# Altium schematic sheet S7CAS-PLEIADES-CARTE-MERE_P20_FPGA-decoupling.SchDoc
size Tabloid; Sheet_Name: Insert name in Document Parameters; Size: 11x17
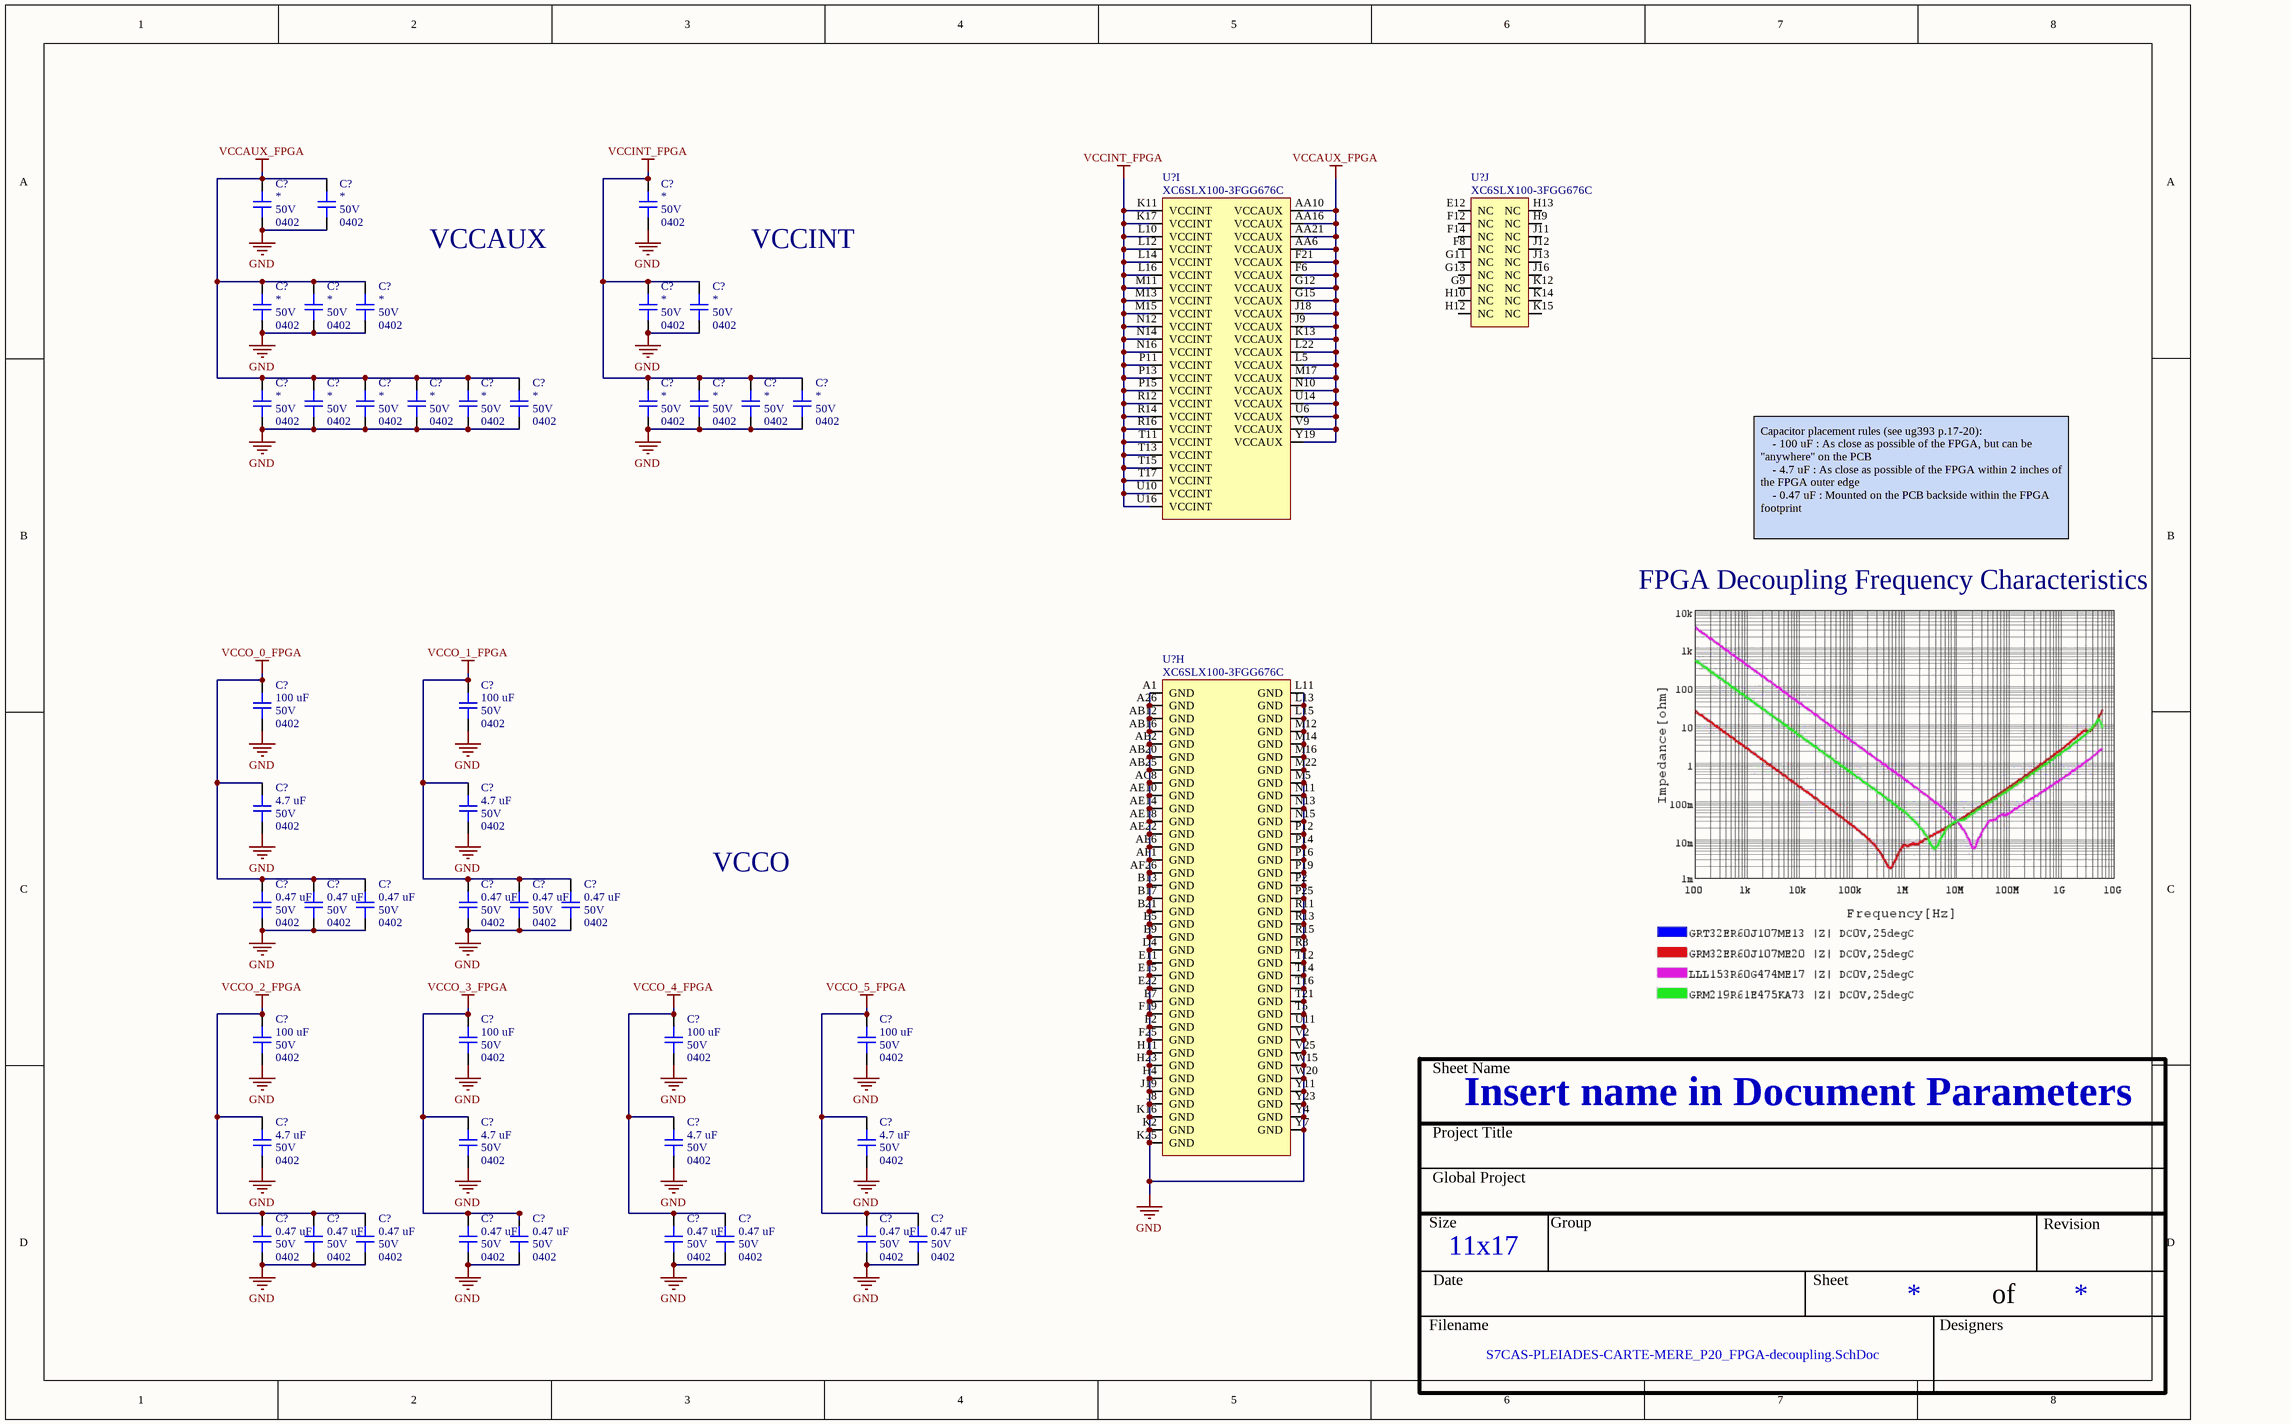
[diagram p0: S7CAS-PLEIADES-CARTE-MERE_P20_FPGA-decoupling.SchDoc]

## Parts
(Parts that share a designator on the sheet are numbered #1, #2 ... from top to bottom, then left to right.)
C?#1  Voltage: 50V  Package: 0402  [CAP_0402]  (hidden comment: CAP - 0402)
C?#2  Voltage: 50V  Package: 0402  [CAP_0402]  (hidden comment: CAP - 0402)
C?#3  Voltage: 50V  Package: 0402  [CAP_0402]  (hidden comment: CAP - 0402)
C?#4  Voltage: 50V  Package: 0402  [CAP_0402]  (hidden comment: CAP - 0402)
C?#5  Voltage: 50V  Package: 0402  [CAP_0402]  (hidden comment: CAP - 0402)
C?#6  Voltage: 50V  Package: 0402  [CAP_0402]  (hidden comment: CAP - 0402)
C?#7  Voltage: 50V  Package: 0402  [CAP_0402]  (hidden comment: CAP - 0402)
C?#8  Voltage: 50V  Package: 0402  [CAP_0402]  (hidden comment: CAP - 0402)
C?#9  Voltage: 50V  Package: 0402  [CAP_0402]  (hidden comment: CAP - 0402)
C?#10  Voltage: 50V  Package: 0402  [CAP_0402]  (hidden comment: CAP - 0402)
C?#11  Voltage: 50V  Package: 0402  [CAP_0402]  (hidden comment: CAP - 0402)
C?#12  Voltage: 50V  Package: 0402  [CAP_0402]  (hidden comment: CAP - 0402)
C?#13  Voltage: 50V  Package: 0402  [CAP_0402]  (hidden comment: CAP - 0402)
C?#14  Voltage: 50V  Package: 0402  [CAP_0402]  (hidden comment: CAP - 0402)
C?#15  Voltage: 50V  Package: 0402  [CAP_0402]  (hidden comment: CAP - 0402)
C?#16  Voltage: 50V  Package: 0402  [CAP_0402]  (hidden comment: CAP - 0402)
C?#17  Voltage: 50V  Package: 0402  [CAP_0402]  (hidden comment: CAP - 0402)
C?#18  Voltage: 50V  Package: 0402  [CAP_0402]  (hidden comment: CAP - 0402)
C?#19  value 100 uF  Voltage: 50V  Package: 0402  [CAP_0402]  (hidden comment: CAP - 0402)
C?#20  value 100 uF  Voltage: 50V  Package: 0402  [CAP_0402]  (hidden comment: CAP - 0402)
C?#21  value 4.7 uF  Voltage: 50V  Package: 0402  [CAP_0402]  (hidden comment: CAP - 0402)
C?#22  value 4.7 uF  Voltage: 50V  Package: 0402  [CAP_0402]  (hidden comment: CAP - 0402)
C?#23  value 0.47 uF  Voltage: 50V  Package: 0402  [CAP_0402]  (hidden comment: CAP - 0402)
C?#24  value 0.47 uF  Voltage: 50V  Package: 0402  [CAP_0402]  (hidden comment: CAP - 0402)
C?#25  value 0.47 uF  Voltage: 50V  Package: 0402  [CAP_0402]  (hidden comment: CAP - 0402)
C?#26  value 0.47 uF  Voltage: 50V  Package: 0402  [CAP_0402]  (hidden comment: CAP - 0402)
C?#27  value 0.47 uF  Voltage: 50V  Package: 0402  [CAP_0402]  (hidden comment: CAP - 0402)
C?#28  value 0.47 uF  Voltage: 50V  Package: 0402  [CAP_0402]  (hidden comment: CAP - 0402)
C?#29  value 100 uF  Voltage: 50V  Package: 0402  [CAP_0402]  (hidden comment: CAP - 0402)
C?#30  value 100 uF  Voltage: 50V  Package: 0402  [CAP_0402]  (hidden comment: CAP - 0402)
C?#31  value 100 uF  Voltage: 50V  Package: 0402  [CAP_0402]  (hidden comment: CAP - 0402)
C?#32  value 100 uF  Voltage: 50V  Package: 0402  [CAP_0402]  (hidden comment: CAP - 0402)
C?#33  value 4.7 uF  Voltage: 50V  Package: 0402  [CAP_0402]  (hidden comment: CAP - 0402)
C?#34  value 4.7 uF  Voltage: 50V  Package: 0402  [CAP_0402]  (hidden comment: CAP - 0402)
C?#35  value 4.7 uF  Voltage: 50V  Package: 0402  [CAP_0402]  (hidden comment: CAP - 0402)
C?#36  value 4.7 uF  Voltage: 50V  Package: 0402  [CAP_0402]  (hidden comment: CAP - 0402)
C?#37  value 0.47 uF  Voltage: 50V  Package: 0402  [CAP_0402]  (hidden comment: CAP - 0402)
C?#38  value 0.47 uF  Voltage: 50V  Package: 0402  [CAP_0402]  (hidden comment: CAP - 0402)
C?#39  value 0.47 uF  Voltage: 50V  Package: 0402  [CAP_0402]  (hidden comment: CAP - 0402)
C?#40  value 0.47 uF  Voltage: 50V  Package: 0402  [CAP_0402]  (hidden comment: CAP - 0402)
C?#41  value 0.47 uF  Voltage: 50V  Package: 0402  [CAP_0402]  (hidden comment: CAP - 0402)
C?#42  value 0.47 uF  Voltage: 50V  Package: 0402  [CAP_0402]  (hidden comment: CAP - 0402)
C?#43  value 0.47 uF  Voltage: 50V  Package: 0402  [CAP_0402]  (hidden comment: CAP - 0402)
C?#44  value 0.47 uF  Voltage: 50V  Package: 0402  [CAP_0402]  (hidden comment: CAP - 0402)
C?#45  value 0.47 uF  Voltage: 50V  Package: 0402  [CAP_0402]  (hidden comment: CAP - 0402)
U?#1  XC6SLX100-3FGG676C  [FPGA_XILINX_FGG676]  (part I of 10)
U?#2  XC6SLX100-3FGG676C  [FPGA_XILINX_FGG676]  (part J of 10)
U?#3  XC6SLX100-3FGG676C  [FPGA_XILINX_FGG676]  (part H of 10)

## Nets
GND: C?#1.1 C?#2.1 C?#3.1 C?#4.1 C?#5.1 C?#6.1 C?#7.1 C?#8.1 C?#9.1 C?#10.1 C?#11.1 C?#12.1 C?#13.1 C?#14.1 C?#15.1 C?#16.1 C?#17.1 C?#18.1 C?#19.1 C?#20.1 C?#21.1 C?#22.1 C?#23.1 C?#24.1 C?#25.1 C?#26.1 C?#27.1 C?#28.1 C?#29.1 C?#30.1 C?#31.1 C?#32.1 C?#33.1 C?#34.1 C?#35.1 C?#36.1 C?#37.1 C?#38.1 C?#39.1 C?#40.1 C?#41.1 C?#42.1 C?#43.1 C?#44.1 C?#45.1 U?#3.A1(GND) U?#3.A26(GND) U?#3.AB2(GND) U?#3.AB12(GND) U?#3.AB16(GND) U?#3.AB20(GND) U?#3.AB25(GND) U?#3.AC8(GND) U?#3.AE6(GND) U?#3.AE10(GND) U?#3.AE14(GND) U?#3.AE18(GND) U?#3.AE22(GND) U?#3.AF1(GND) U?#3.AF26(GND) U?#3.B5(GND) U?#3.B9(GND) U?#3.B13(GND) U?#3.B17(GND) U?#3.B21(GND) U?#3.D4(GND) U?#3.E7(GND) U?#3.E11(GND) U?#3.E15(GND) U?#3.E22(GND) U?#3.F2(GND) U?#3.F19(GND) U?#3.F25(GND) U?#3.H4(GND) U?#3.H11(GND) U?#3.H23(GND) U?#3.J8(GND) U?#3.J19(GND) U?#3.K2(GND) U?#3.K16(GND) U?#3.K25(GND) U?#3.L11(GND) U?#3.L13(GND) U?#3.L15(GND) U?#3.M5(GND) U?#3.M12(GND) U?#3.M14(GND) U?#3.M16(GND) U?#3.M22(GND) U?#3.N11(GND) U?#3.N13(GND) U?#3.N15(GND) U?#3.P2(GND) U?#3.P12(GND) U?#3.P14(GND) U?#3.P16(GND) U?#3.P19(GND) U?#3.P25(GND) U?#3.R8(GND) U?#3.R11(GND) U?#3.R13(GND) U?#3.R15(GND) U?#3.T5(GND) U?#3.T12(GND) U?#3.T14(GND) U?#3.T16(GND) U?#3.T21(GND) U?#3.U11(GND) U?#3.V2(GND) U?#3.V25(GND) U?#3.W15(GND) U?#3.W20(GND) U?#3.Y4(GND) U?#3.Y7(GND) U?#3.Y11(GND) U?#3.Y23(GND)
VCCAUX_FPGA: C?#1.2 C?#2.2 C?#4.2 C?#5.2 C?#6.2 C?#9.2 C?#10.2 C?#11.2 C?#12.2 C?#13.2 C?#14.2 U?#1.AA6(VCCAUX) U?#1.AA10(VCCAUX) U?#1.AA16(VCCAUX) U?#1.AA21(VCCAUX) U?#1.F6(VCCAUX) U?#1.F21(VCCAUX) U?#1.G12(VCCAUX) U?#1.G15(VCCAUX) U?#1.J9(VCCAUX) U?#1.J18(VCCAUX) U?#1.K13(VCCAUX) U?#1.L5(VCCAUX) U?#1.L22(VCCAUX) U?#1.M17(VCCAUX) U?#1.N10(VCCAUX) U?#1.U6(VCCAUX) U?#1.U14(VCCAUX) U?#1.V9(VCCAUX) U?#1.Y19(VCCAUX)
VCCINT_FPGA: C?#3.2 C?#7.2 C?#8.2 C?#15.2 C?#16.2 C?#17.2 C?#18.2 U?#1.K11(VCCINT) U?#1.K17(VCCINT) U?#1.L10(VCCINT) U?#1.L12(VCCINT) U?#1.L14(VCCINT) U?#1.L16(VCCINT) U?#1.M11(VCCINT) U?#1.M13(VCCINT) U?#1.M15(VCCINT) U?#1.N12(VCCINT) U?#1.N14(VCCINT) U?#1.N16(VCCINT) U?#1.P11(VCCINT) U?#1.P13(VCCINT) U?#1.P15(VCCINT) U?#1.R12(VCCINT) U?#1.R14(VCCINT) U?#1.R16(VCCINT) U?#1.T11(VCCINT) U?#1.T13(VCCINT) U?#1.T15(VCCINT) U?#1.T17(VCCINT) U?#1.U10(VCCINT) U?#1.U16(VCCINT)
VCCO_0_FPGA: C?#19.2 C?#21.2 C?#23.2 C?#24.2 C?#25.2
VCCO_1_FPGA: C?#20.2 C?#22.2 C?#26.2 C?#27.2 C?#28.2
VCCO_2_FPGA: C?#29.2 C?#33.2 C?#37.2 C?#38.2 C?#39.2
VCCO_3_FPGA: C?#30.2 C?#34.2 C?#40.2 C?#41.2
VCCO_4_FPGA: C?#31.2 C?#35.2 C?#42.2 C?#43.2
VCCO_5_FPGA: C?#32.2 C?#36.2 C?#44.2 C?#45.2

Not connected (* = marked no-connect by the designer): U?#2 E12(NC) F8(NC) F12(NC) F14(NC) G9(NC) G11(NC) G13(NC) H9(NC) H10(NC) H12(NC) H13(NC) J11(NC) J12(NC) J13(NC) J16(NC) K12(NC) K14(NC) K15(NC)

## Notes on the sheet
- VCCAUX
- VCCINT
- Capacitor placement rules (see ug393 p.17-20):
  - 100 uF : As close as possible of the FPGA, but can be "anywhere" on the PCB
  - 4.7 uF : As close as possible of the FPGA within 2 inches of the FPGA outer edge
  - 0.47 uF : Mounted on the PCB backside within the FPGA footprint
- FPGA Decoupling Frequency Characteristics
- VCCO
- Sheet Name
- Project Title
- Global Project
- Size
- Group
- Revision
- Date
- Sheet
- of
- Filename
- Designers

## Library data of the parts
C?#1-C?#45 = CAP - 0402: Precision: 10%; Current: *; CreatedBy: Jonathan Bouchard; Power: *
  C?#1-C?#18: Value: *
U?#1-U?#3 = FPGA_XC6SLX100-3FGG676C: FPGA - XILINX SPARTAN 6 480 I/O - BGA-676; Voltage: 1.14 V ~ 1.26 V; Current: *; Power: *; Mfg: Xilinx; Mfg Part Number: XC6SLX100-3FGG676C; HelpURL: https://www.xilinx.com/support/documentation/data_sheets/ds162.pdf; CreatedBy: Jonathan Bouchard; Temperature: 0°C ~ 85°C (TJ); Value: *; Precision: *; Package: BGA-676; Supplier 1: Digikey; Supplier Part Number 1: 122-1760-ND